# Altium project Hydra A1 UCLO 35131D.PrjPCB (part 8 of 14)

## Sheet Power Distribution Block Diagram.SchDoc: Power Distribution Block Diagram
size D; DrawnBy: C. Lewis; Engineer: C. Lewis; Address1: 4650 NORRIS CANYON RD.; Address2: SAN RAMON, CA 94583; DocumentNumber: 35133; Revision: D; SheetNumber: 17; SheetTotal: 20; PageSetup: Record=PageOptions|CenterHorizontal=True|CenterVertical=True|PrintScale=0.51|XCorrection=1.00|YCorrection=1.00|PrintKind=1|BorderSize=5000000|LeftOffset=0|BottomOffset=0|Orientation=2|PaperLength=1000|PaperWidth=1000|Scale=100|PaperSource=15|PrintQuality=600|MediaType=1|DitherType=10|PaperKind=11x17|PrintScaleMode=1
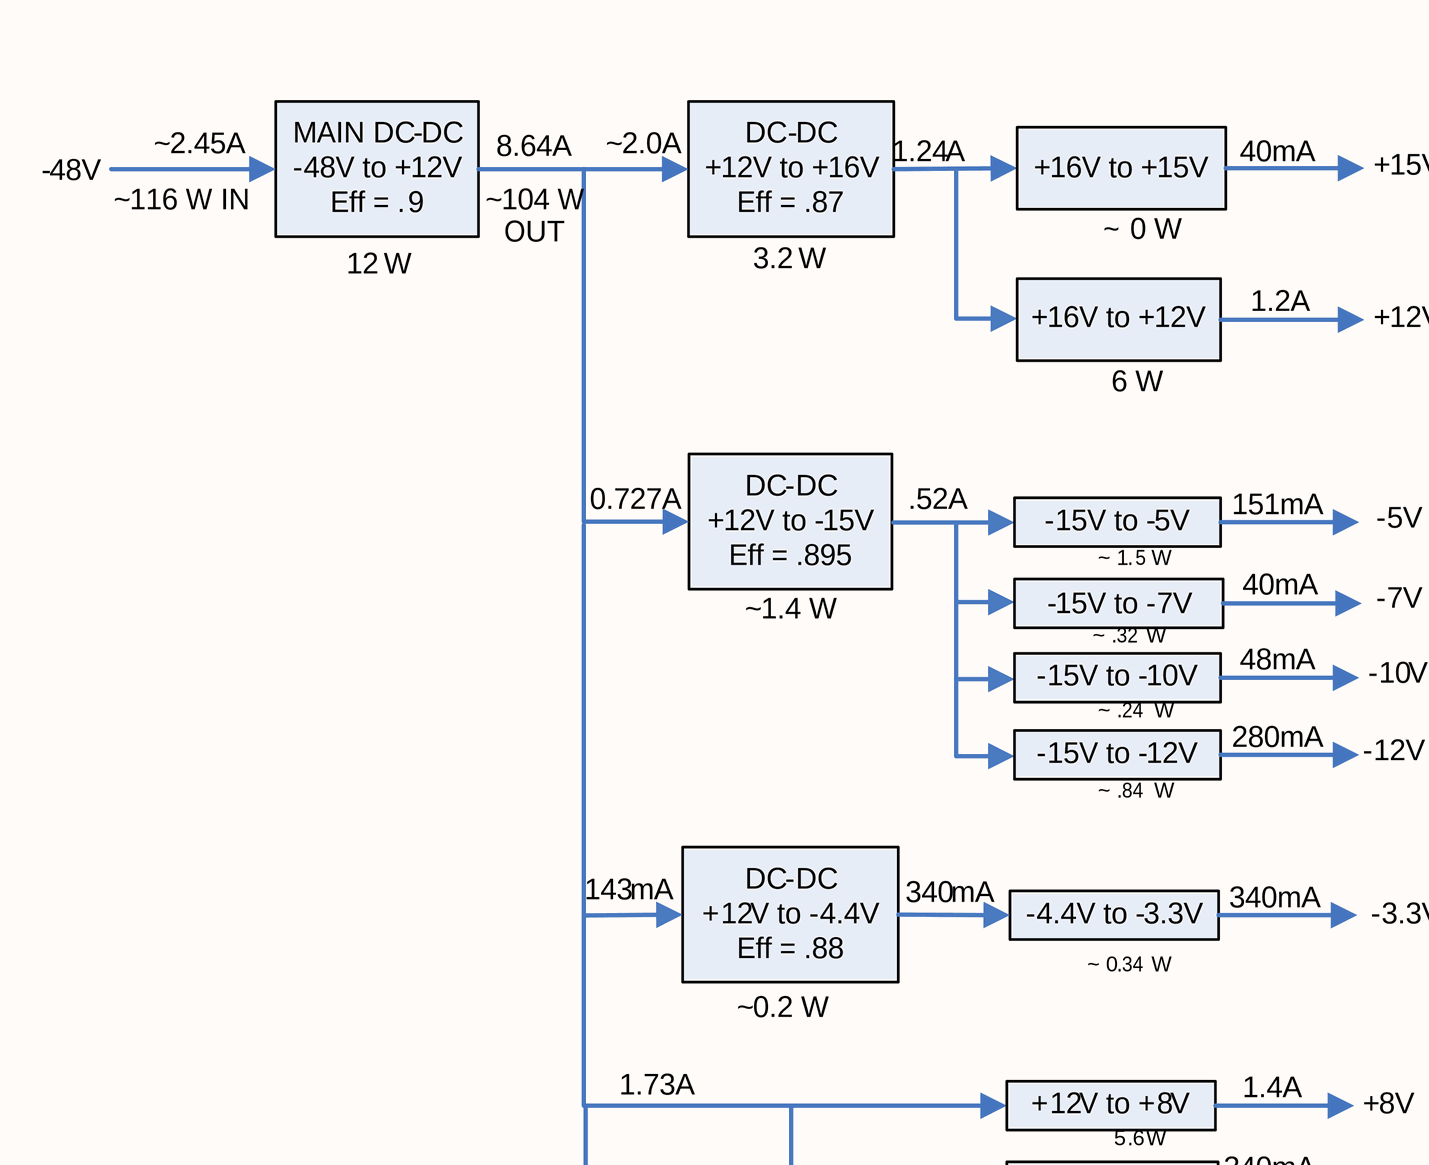
[diagram p38: Power Distribution Block Diagram.SchDoc, top left]
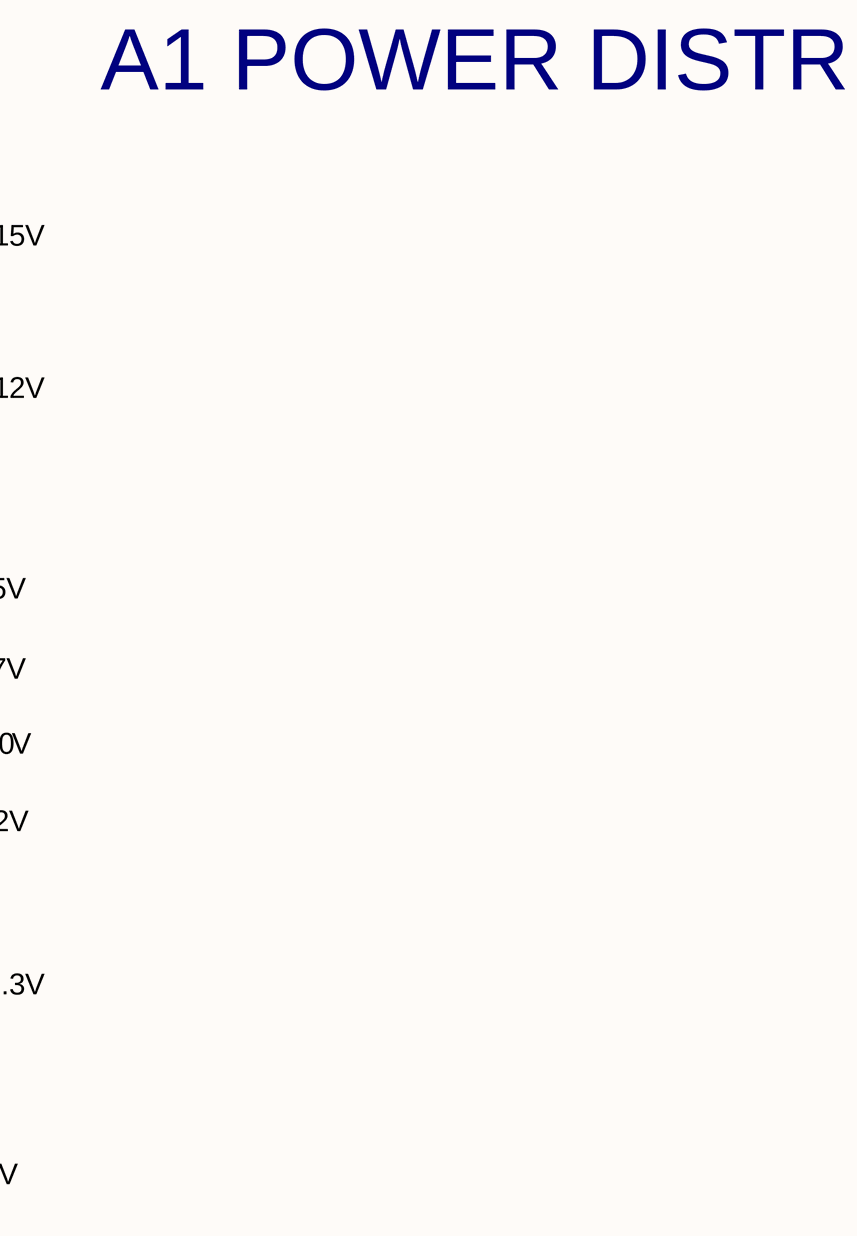
[diagram p39: Power Distribution Block Diagram.SchDoc, top middle]
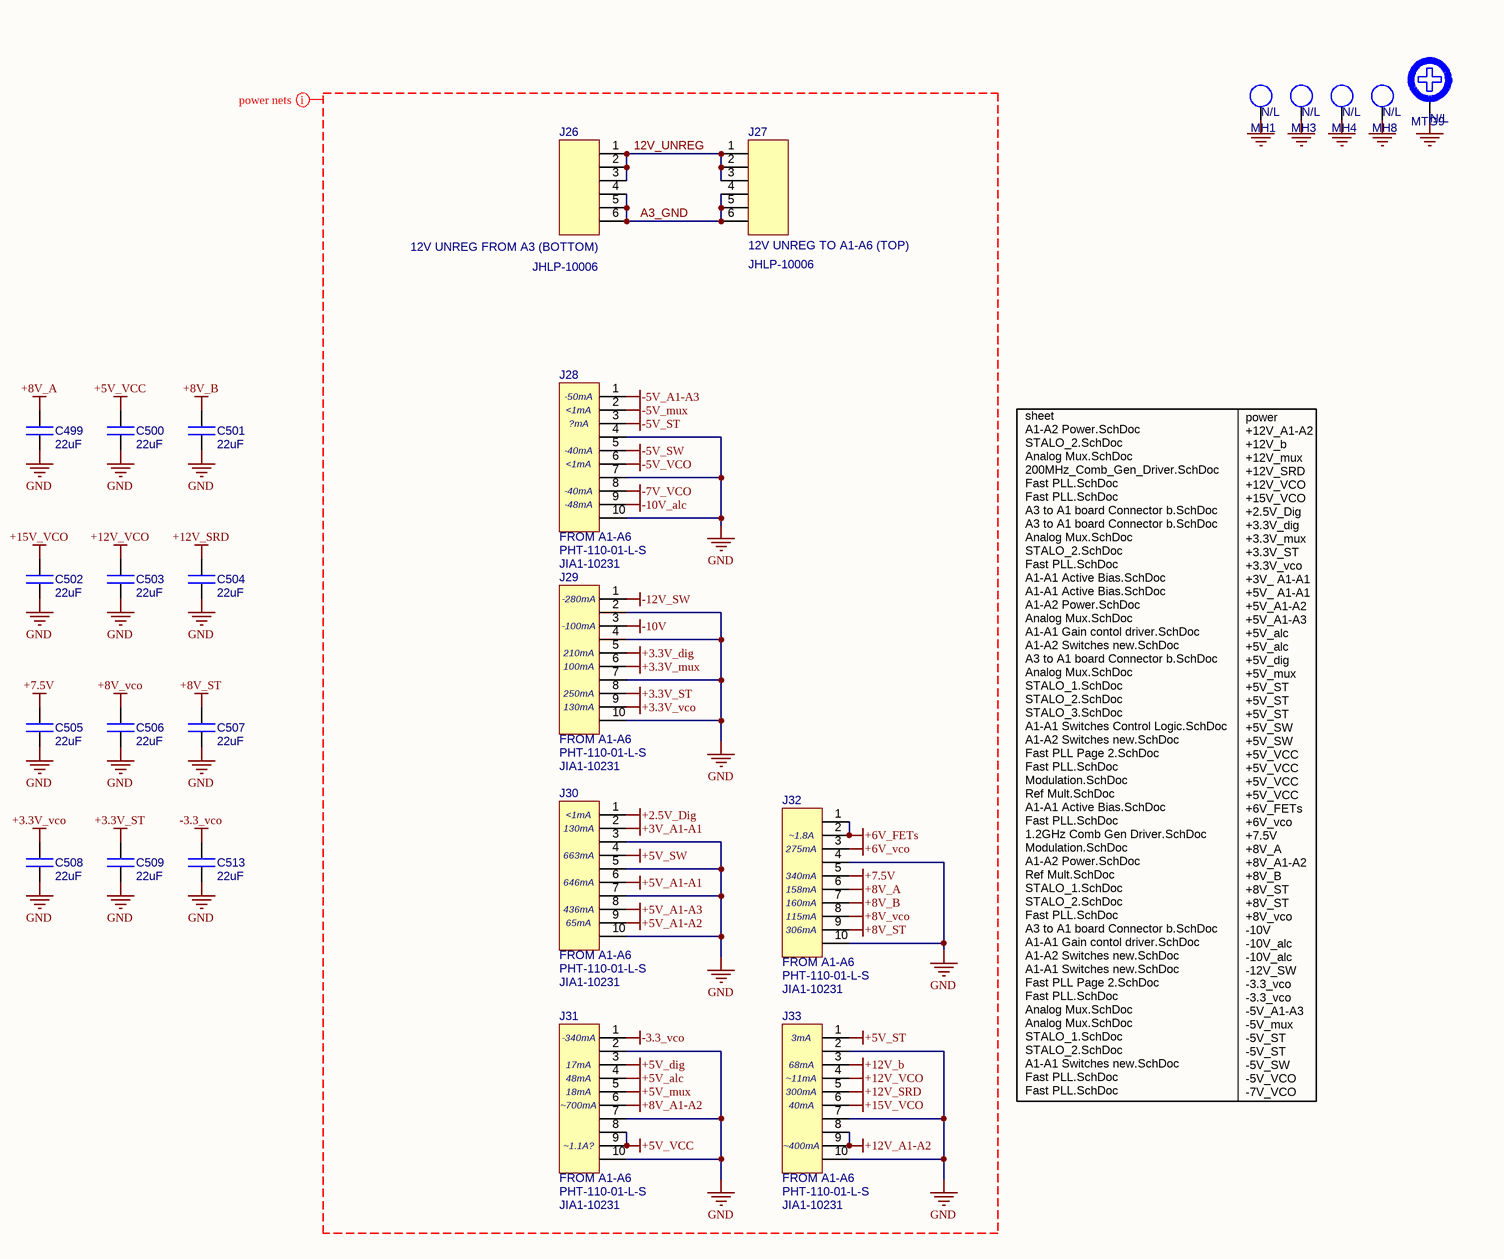
[diagram p40: Power Distribution Block Diagram.SchDoc, top right]
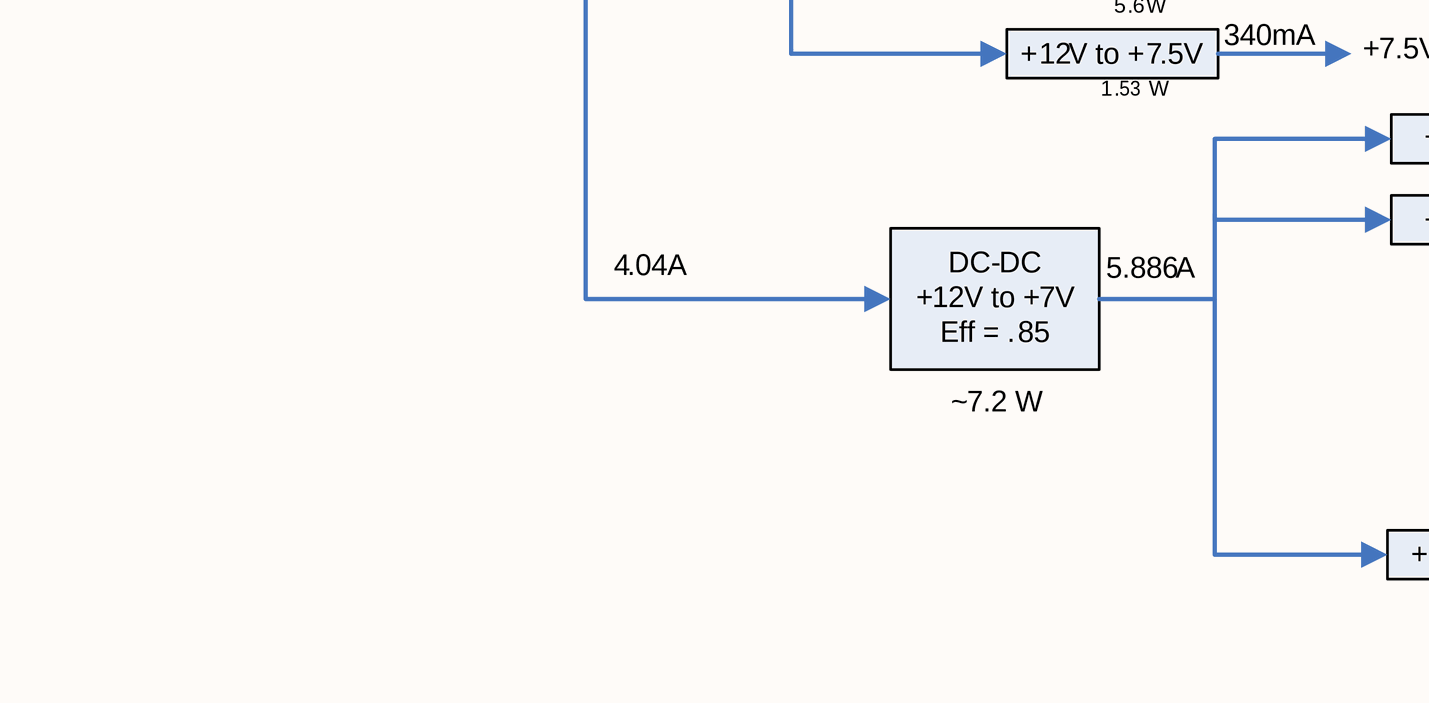
[diagram p41: Power Distribution Block Diagram.SchDoc, bottom left]
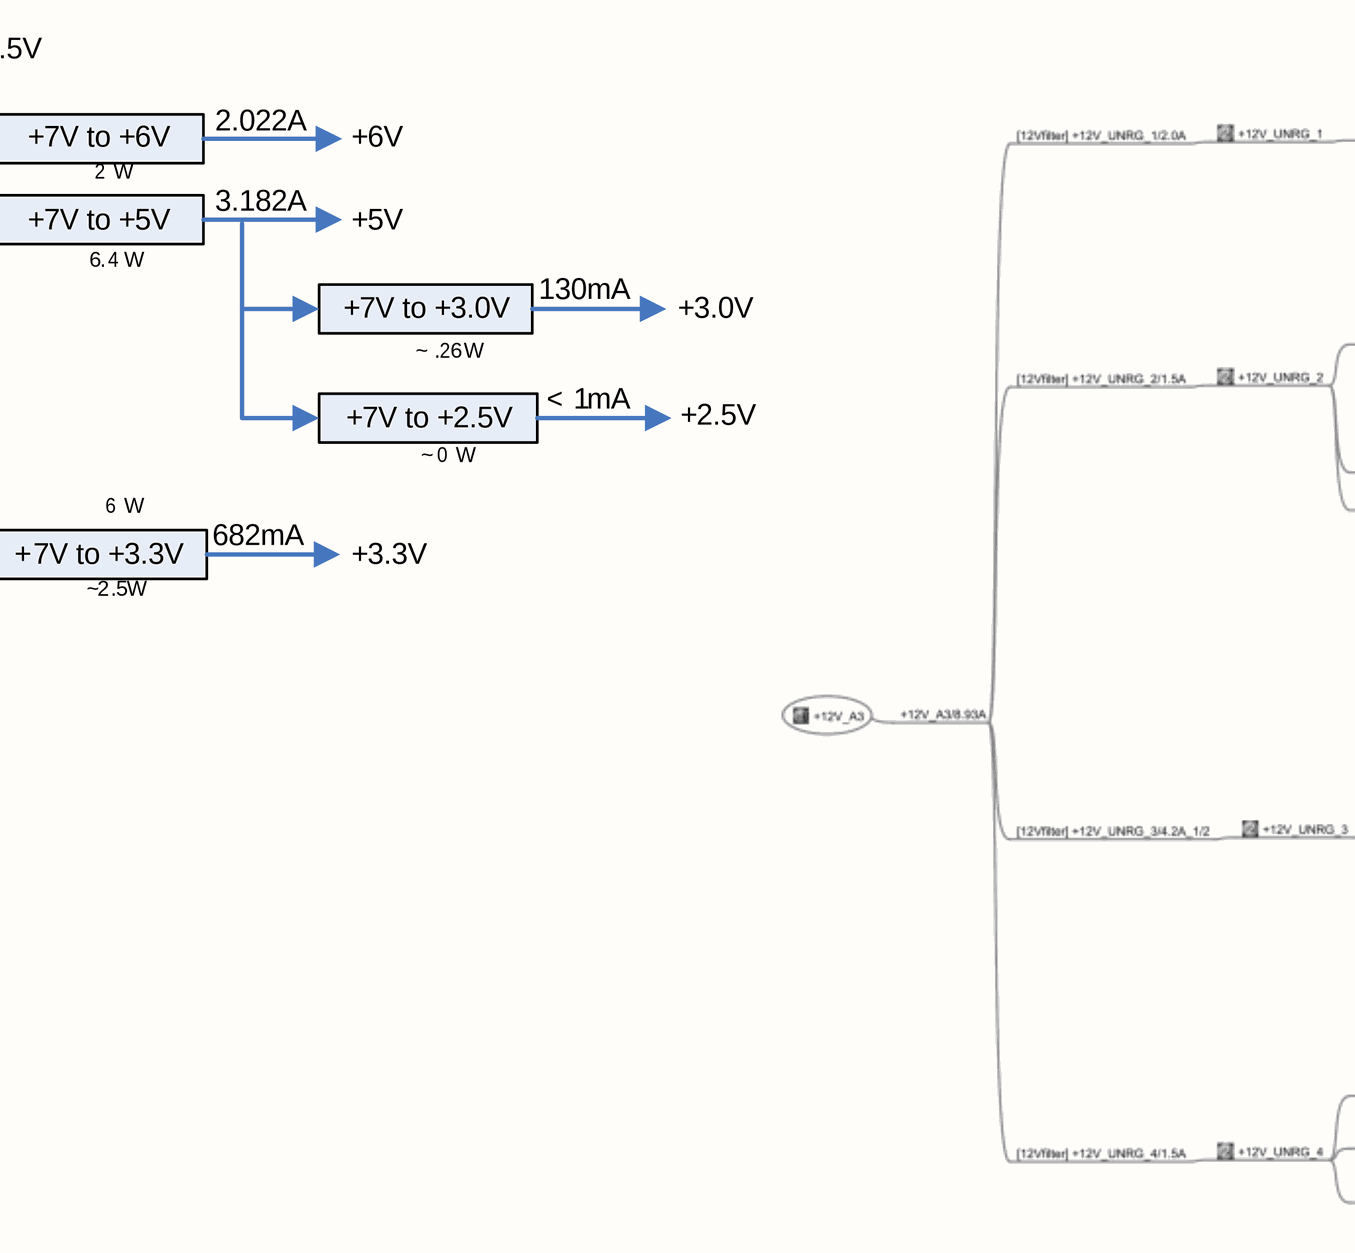
[diagram p42: Power Distribution Block Diagram.SchDoc, bottom middle]
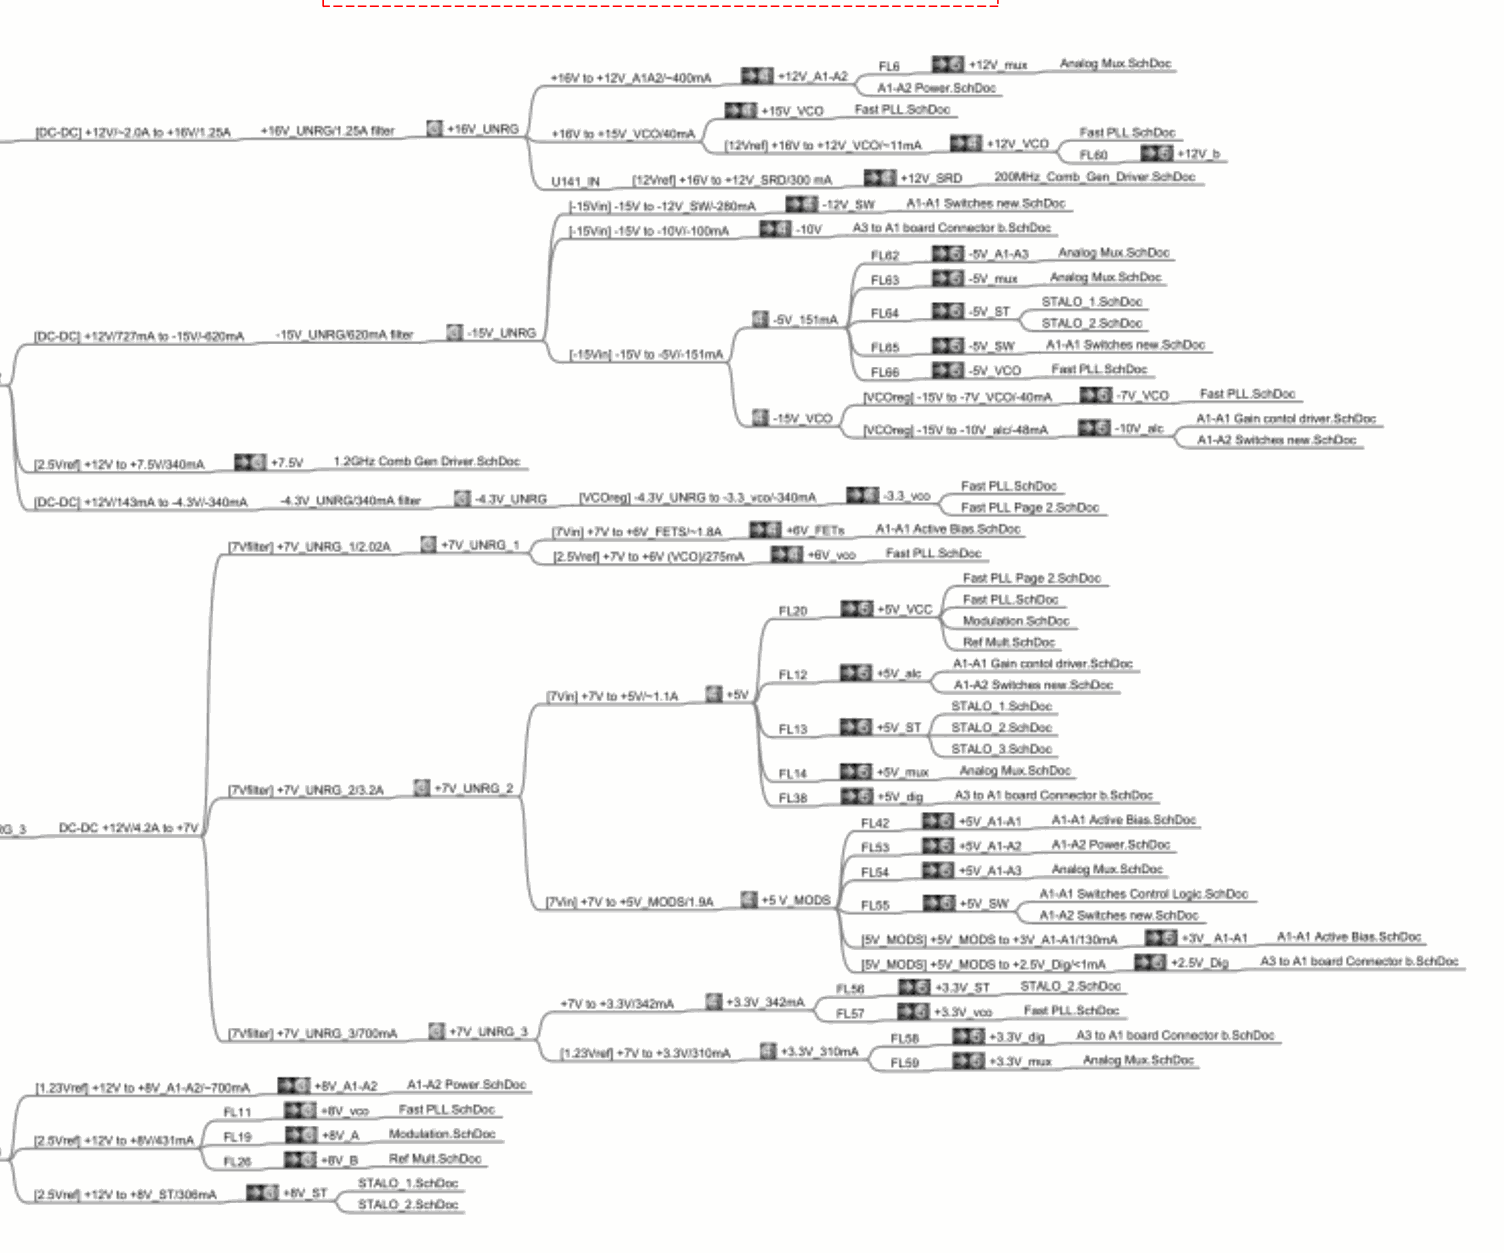
[diagram p43: Power Distribution Block Diagram.SchDoc, bottom right]

### Parts
C499  value 22uF  [CAP-1210-N]  (hidden comment: 22uF;X5R;CERAMIC CHIP;25V;1210)
C500  value 22uF  [CAP-1210-N]  (hidden comment: 22uF;X5R;CERAMIC CHIP;25V;1210)
C501  value 22uF  [CAP-1210-N]  (hidden comment: 22uF;X5R;CERAMIC CHIP;25V;1210)
C502  value 22uF  [CAP-1210-N]  (hidden comment: 22uF;X5R;CERAMIC CHIP;25V;1210)
C503  value 22uF  [CAP-1210-N]  (hidden comment: 22uF;X5R;CERAMIC CHIP;25V;1210)
C504  value 22uF  [CAP-1210-N]  (hidden comment: 22uF;X5R;CERAMIC CHIP;25V;1210)
C505  value 22uF  [CAP-1210-N]  (hidden comment: 22uF;X5R;CERAMIC CHIP;25V;1210)
C506  value 22uF  [CAP-1210-N]  (hidden comment: 22uF;X5R;CERAMIC CHIP;25V;1210)
C507  value 22uF  [CAP-1210-N]  (hidden comment: 22uF;X5R;CERAMIC CHIP;25V;1210)
C508  value 22uF  [CAP-1210-N]  (hidden comment: 22uF;X5R;CERAMIC CHIP;25V;1210)
C509  value 22uF  [CAP-1210-N]  (hidden comment: 22uF;X5R;CERAMIC CHIP;25V;1210)
C513  value 22uF  [CAP-1210-N]  (hidden comment: 22uF;X5R;CERAMIC CHIP;25V;1210)
J26  12V UNREG FROM A3 (BOTTOM)  [JHLP-10006]
J27  12V UNREG TO A1-A6 (TOP)  [JHLP-10006]
J28  FROM A1-A6  M_PN: PHT-110-01-L-S  [JIA1-10231]
J29  FROM A1-A6  M_PN: PHT-110-01-L-S  [JIA1-10231]
J30  FROM A1-A6  M_PN: PHT-110-01-L-S  [JIA1-10231]
J31  FROM A1-A6  M_PN: PHT-110-01-L-S  [JIA1-10231]
J32  FROM A1-A6  M_PN: PHT-110-01-L-S  [JIA1-10231]
J33  FROM A1-A6  M_PN: PHT-110-01-L-S  [JIA1-10231]
MH1  N/L  [MHP-250X116]
MH3  N/L  [MHP-250X116]
MH4  N/L  [MHP-250X116]
MH8  N/L  [MHP-250X116]
MTG9  NoLoad: N/L  [MHP-250X116]

### Nets
+2.5V_Dig: J30.1
+3.3V_dig: J29.5
+3.3V_mux: J29.6
+3.3V_ST: C509.2 J29.8
+3.3V_vco: C508.2 J29.9
+3V_A1-A1: J30.2
+5V_A1-A1: J30.6
+5V_A1-A2: J30.9
+5V_A1-A3: J30.8
+5V_alc: J31.4
+5V_dig: J31.3
+5V_mux: J31.5
+5V_ST: J33.1
+5V_SW: J30.4
+5V_VCC: C500.2 J31.8 J31.9
+6V_FETs: J32.1 J32.2
+6V_vco: J32.3
+7.5V: C505.2 J32.5
+8V_A: C499.2 J32.6
+8V_A1-A2: J31.6
+8V_B: C501.2 J32.7
+8V_ST: C507.2 J32.9
+8V_vco: C506.2 J32.8
+12V_A1-A2: J33.8 J33.9
+12V_b: J33.3
+12V_SRD: C504.2 J33.5
+12V_VCO: C503.2 J33.4
+15V_VCO: C502.2 J33.6
-3.3_vco: C513.2 J31.1
-5V_A1-A3: J28.1
-5V_mux: J28.2
-5V_ST: J28.3
-5V_SW: J28.5
-5V_VCO: J28.6
-7V_VCO: J28.8
-10V: J29.3
-10V_alc: J28.9
-12V_SW: J29.1
GND: C499.1 C500.1 C501.1 C502.1 C503.1 C504.1 C505.1 C506.1 C507.1 C508.1 C509.1 C513.1 J28.4 J28.7 J28.10 J29.2 J29.4 J29.7 J29.10 J30.3 J30.5 J30.7 J30.10 J31.2 J31.7 J31.10 J32.4 J32.10 J33.2 J33.7 J33.10 MH1.MH MH3.MH MH4.MH MH8.MH MTG9.MH
12V_UNREG: J26.1 J26.2 J26.3 J27.1 J27.2 J27.3
A3_GND: J26.4 J26.5 J26.6 J27.4 J27.5 J27.6

### Layout directives
net class power nets: 12V_UNREG, +2.5V_Dig, +3.3V_dig, +3.3V_mux, +3.3V_ST, +3.3V_vco, +3V_A1-A1, +5V_A1-A1, +5V_A1-A2, +5V_A1-A3, +5V_alc, +5V_dig, +5V_mux, +5V_ST, +5V_SW, +5V_VCC, +6V_FETs, +6V_vco, +7.5V, +8V_A, +8V_A1-A2, +8V_B, +8V_ST, +8V_vco, +12V_A1-A2, +12V_b, +12V_SRD, +12V_VCO, +15V_VCO, -3.3_vco, -5V_A1-A3, -5V_mux, -5V_ST, -5V_SW, -5V_VCO, -7V_VCO, -10V, -10V_alc, -12V_SW, A3_GND, GND

### Notes on the sheet
- A1 POWER DISTRIBUTION
- (near J28) -50mA
- (near J28) <1mA
- (near J28) -40mA
- (near J28) ?mA
- (near J28) -48mA
- (near J29) -280mA
- (near J29) -100mA
- (near J29) 210mA
- (near J29) 100mA
- (near J29) 250mA
- (near J29) 130mA
- (near J30) <1mA
- (near J30) 130mA
- (near J30) 646mA
- (near J30) 663mA
- (near J32) ~1.8A
- (near J32) 275mA
- (near J32) 340mA
- (near J32) 158mA
- (near J30) 65mA
- (near J30) 436mA
- (near J32) 160mA
- (near J32) 306mA
- (near J32) 115mA
- (near J31) -340mA
- (near J31) 17mA
- (near J31) 48mA
- (near J33) 3mA
- (near J33) 68mA
- (near J33) ~11mA
- (near J31) ~1.1A?
- (near J31) 18mA
- (near J31) ~700mA
- (near J33) ~400mA
- (near J33) 300mA
- (near J33) 40mA
- sheet
  A1-A2 Power.SchDoc
  STALO_2.SchDoc
  Analog Mux.SchDoc
  200MHz_Comb_Gen_Driver.SchDoc
  Fast PLL.SchDoc
  Fast PLL.SchDoc
  A3 to A1 board Connector b.SchDoc
  A3 to A1 board Connector b.SchDoc
  Analog Mux.SchDoc
  STALO_2.SchDoc
  Fast PLL.SchDoc
  A1-A1 Active Bias.SchDoc
  A1-A1 Active Bias.SchDoc
  A1-A2 Power.SchDoc
  Analog Mux.SchDoc
  A1-A1 Gain contol driver.SchDoc
  A1-A2 Switches new.SchDoc
  A3 to A1 board Connector b.SchDoc
  Analog Mux.SchDoc
  STALO_1.SchDoc
  STALO_2.SchDoc
  STALO_3.SchDoc
  A1-A1 Switches Control Logic.SchDoc
  A1-A2 Switches new.SchDoc
  Fast PLL Page 2.SchDoc
  Fast PLL.SchDoc
  Modulation.SchDoc
  Ref Mult.SchDoc
  A1-A1 Active Bias.SchDoc
  Fast PLL.SchDoc
  1.2GHz Comb Gen Driver.SchDoc
  Modulation.SchDoc
  A1-A2 Power.SchDoc
  Ref Mult.SchDoc
  STALO_1.SchDoc
  STALO_2.SchDoc
  Fast PLL.SchDoc
  A3 to A1 board Connector b.SchDoc
  A1-A1 Gain contol driver.SchDoc
  A1-A2 Switches new.SchDoc
  A1-A1 Switches new.SchDoc
  Fast PLL Page 2.SchDoc
  Fast PLL.SchDoc
  Analog Mux.SchDoc
  Analog Mux.SchDoc
  STALO_1.SchDoc
  STALO_2.SchDoc
  A1-A1 Switches new.SchDoc
  Fast PLL.SchDoc
  Fast PLL.SchDoc
- power
  +12V_A1-A2
  +12V_b
  +12V_mux
  +12V_SRD
  +12V_VCO
  +15V_VCO
  +2.5V_Dig
  +3.3V_dig
  +3.3V_mux
  +3.3V_ST
  +3.3V_vco
  +3V_ A1-A1
  +5V_ A1-A1
  +5V_A1-A2
  +5V_A1-A3
  +5V_alc
  +5V_alc
  +5V_dig
  +5V_mux
  +5V_ST
  +5V_ST
  +5V_ST
  +5V_SW
  +5V_SW
  +5V_VCC
  +5V_VCC
  +5V_VCC
  +5V_VCC
  +6V_FETs
  +6V_vco
  +7.5V
  +8V_A
  +8V_A1-A2
  +8V_B
  +8V_ST
  +8V_ST
  +8V_vco
  -10V
  -10V_alc
  -10V_alc
  -12V_SW
  -3.3_vco
  -3.3_vco
  -5V_A1-A3
  -5V_mux
  -5V_ST
  -5V_ST
  -5V_SW
  -5V_VCO
  -7V_VCO
- Title
- Sheet Title
- PRINTED DOCUMENT IS CONSIDERED UNCONTROLLED. VERIFY REVISION IN PLM SYSTEM.
- THIS DOCUMENT CONTAINS PROPRIETARY INFORMATION. DESIGN RIGHTS BELONG TO GIGA-TRONICS AND MAY NOT BE REPRODUCED WITHOUT WRITTEN AUTHORIZATION FOR ANY REASON EXCEPT CALIBRATION, OPERATION AND MAINTENANCE.
- Size
- CAGE CODE
- Filename
- D
- Document Number
- 58900
- Date
- Sheet
- Rev
- of

### Library data of the parts
C499-C509 C513 = CK60-26220: Approved: CL; NoLoad: .; MFGR: ANY; level: 1; line_number: 212; G_PN: CK60-26220; ModifyDate: 3/23/13; M_PN: ANY; item_number: CK60-26220
J26 J27 = JHLP-10006: LOCKING HEADER;.1CNTR;6PIN STR; Approved: FV; NoLoad: .; MFGR: AMP; M_PN: 641126-6; level: 1; line_number: 487; ModifyDate: 07/23/2013; G_PN: JHLP-10006; item_number: JHLP-10006
J28-J33 = JIA1-10231: STRIPLINE PLUG;.1 CTR;10 PIN;SINGLE ROW;.230;PRESS FIT;GOLD; NoLoad: .; MFGR: SAMTEC; level: 1; line_number: 490; ModifyDate: 08/14/2013; G_PN: JIA1-10231; item_number: JIA1-10231
MH1 MH3 MH4 MH8 = MHP-250X116: level: 1; NoLoad: N/L; ModifyDate: 02/14/2008 14:07:19; Value: *
MTG9 = MHP250X116: level: 1; ModifyDate: 8/8/13; Value: *

## Sheet A1-A2 Power.SchDoc: A1-A2 Power
size D; DrawnBy: C. Lewis; Engineer: C. Lewis; Address1: 4650 NORRIS CANYON RD.; Address2: SAN RAMON, CA 94583; DocumentNumber: 35133; Revision: D; SheetNumber: 7; SheetTotal: 20
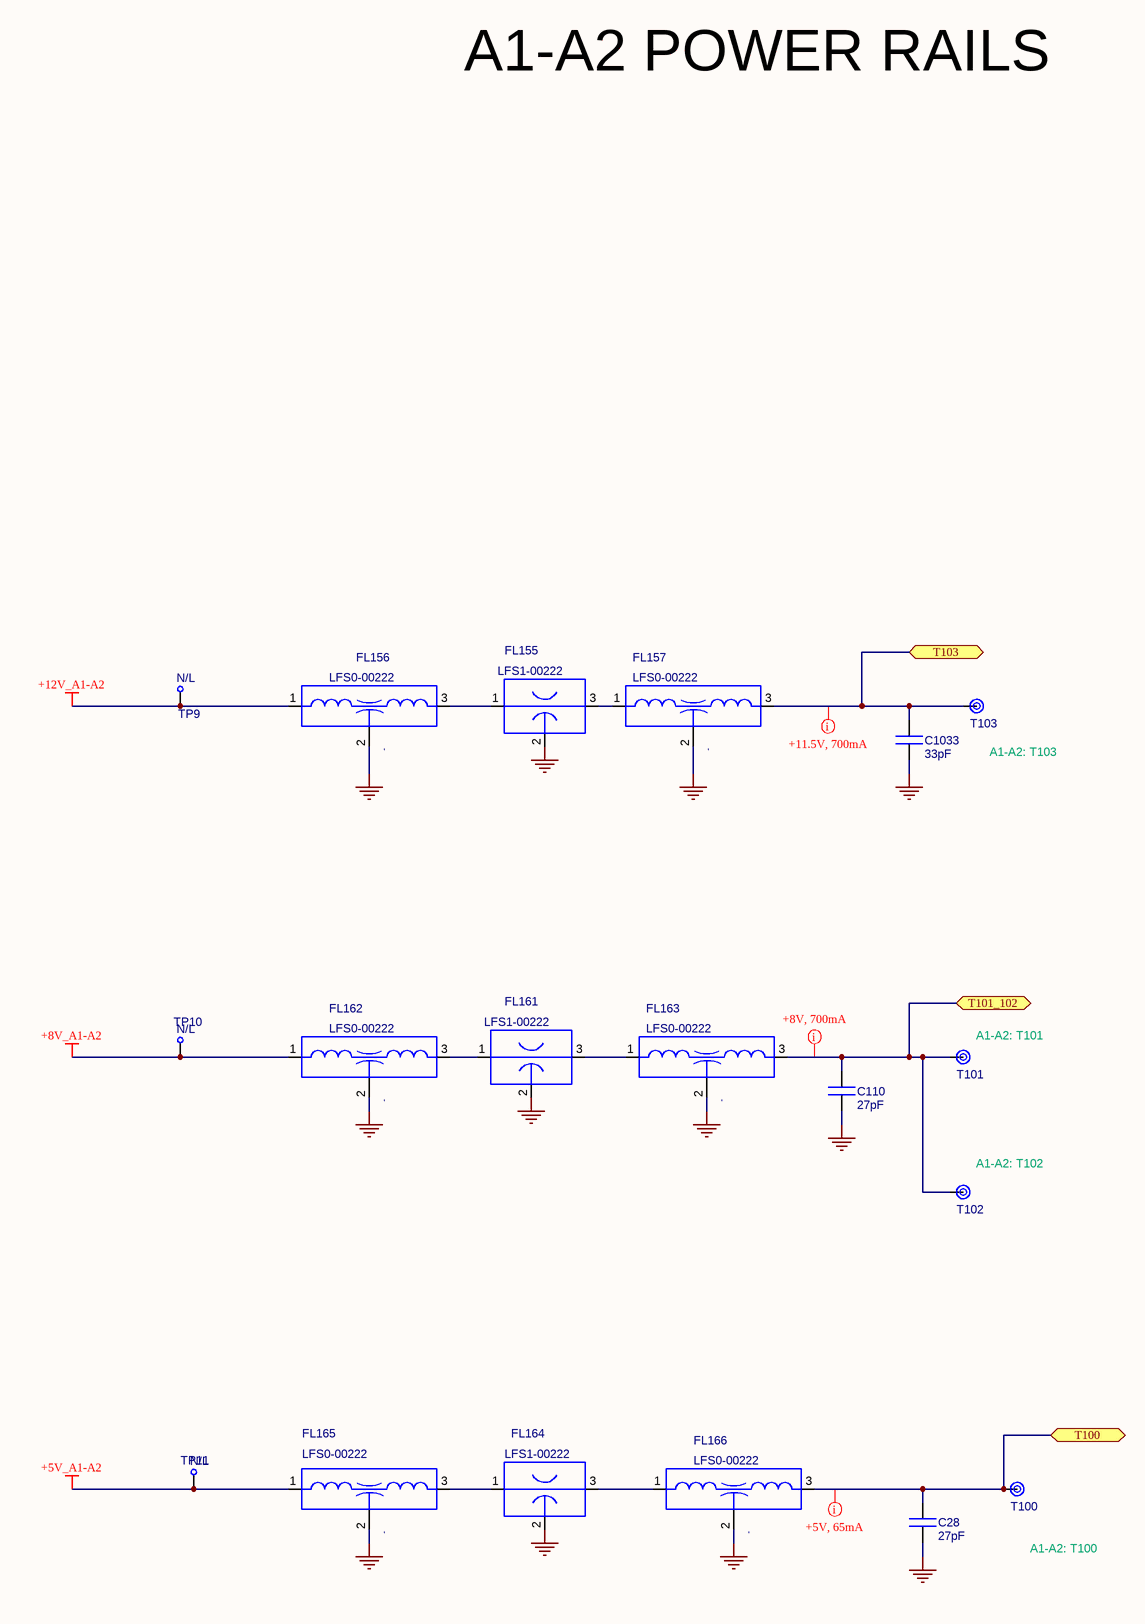
[diagram p44: A1-A2 Power.SchDoc]

### Parts
C28  value 27pF  [CAP-0402-N]  (hidden comment: 27 PF;5%;COG;>50V;CHIP;0402)
C110  value 27pF  [CAP-0402-N]  (hidden comment: 27 PF;5%;COG;>50V;CHIP;0402)
C1033  value 33pF  [CAP-0402-N]  (hidden comment: 33 PF;5%;COG;>50V;CHIP;0402)
FL155  NFM18CC222R1C3  [FIL-NFL18C]  (value not drawn)
FL156  Filter EMI 2200PF,1206  [FIL-NFE31P-1206-4P]  (value not drawn)
FL157  Filter EMI 2200PF,1206  [FIL-NFE31P-1206-4P]  (value not drawn)
FL161  NFM18CC222R1C3  [FIL-NFL18C]  (value not drawn)
FL162  Filter EMI 2200PF,1206  [FIL-NFE31P-1206-4P]  (value not drawn)
FL163  Filter EMI 2200PF,1206  [FIL-NFE31P-1206-4P]  (value not drawn)
FL164  NFM18CC222R1C3  [FIL-NFL18C]  (value not drawn)
FL165  Filter EMI 2200PF,1206  [FIL-NFE31P-1206-4P]  (value not drawn)
FL166  Filter EMI 2200PF,1206  [FIL-NFE31P-1206-4P]  (value not drawn)
T100  A1-A2: T100  [JIB0-11254]
T101  A1-A2: T101  [JIB0-11254]
T102  A1-A2: T102  [JIB0-11254]
T103  A1-A2: T103  [JIB0-11254]
TP9  NoLoad: N/L  [TP-060]  (hidden comment: .)
TP10  NoLoad: N/L  [TP-060]  (hidden comment: .)
TP11  NoLoad: N/L  [TP-060]  (hidden comment: .)

### Ports
T100, T101_102, T103

### Nets
+5V_A1-A2: FL165.1(IN) TP11.1
+8V_A1-A2: FL162.1(IN) TP10.1
+12V_A1-A2: FL156.1(IN) TP9.1
GND: C28.2 C110.1 C1033.1 FL155.2 FL156.2(GND) FL157.2(GND) FL161.2 FL162.2(GND) FL163.2(GND) FL164.2 FL165.2(GND) FL166.2(GND)
NetA1_T100: C28.1 FL166.3(OUT) T100.1 ; port T100
NetA1_T101: C110.2 FL163.3(OUT) T101.1 T102.1 ; port T101_102
NetA1_T103: C1033.2 FL157.3(OUT) T103.1 ; port T103
NetFL155_1: FL155.1 FL156.3(OUT)
NetFL155_3: FL155.3 FL157.1(IN)
NetFL161_1: FL161.1 FL162.3(OUT)
NetFL161_3: FL161.3 FL163.1(IN)
NetFL164_1: FL164.1 FL165.3(OUT)
NetFL164_3: FL164.3 FL166.1(IN)

### Layout directives
net class +11.5V, 700mA: NetA1_T103
net class +8V, 350mA: NetA1_T101
net class +5V, 65mA: NetA1_T100

### Notes on the sheet
- A1-A2 POWER RAILS
- Title
- Sheet Title
- PRINTED DOCUMENT IS CONSIDERED UNCONTROLLED. VERIFY REVISION IN PLM SYSTEM.
- THIS DOCUMENT CONTAINS PROPRIETARY INFORMATION. DESIGN RIGHTS BELONG TO GIGA-TRONICS AND MAY NOT BE REPRODUCED WITHOUT WRITTEN AUTHORIZATION FOR ANY REASON EXCEPT CALIBRATION, OPERATION AND MAINTENANCE.
- Size
- CAGE CODE
- Filename
- D
- Document Number
- 58900
- Date
- Sheet
- Rev
- of
- (in symbol LFS0-00222) ,

### Library data of the parts
C28 = CK40-00270: MFGR: ANY; Approved: CL; NoLoad: .; level: 1; line_number: 215; ModifyDate: 02/22/12; M_PN: ANY; G_PN: CK40-00270; item_number: CK40-00270
C110 = CK40-00270: Approved: CL; MFGR: ANY; NoLoad: .; level: 1; line_number: 215; ModifyDate: 02/22/12; G_PN: CK40-00270; M_PN: ANY; item_number: CK40-00270
C1033 = CK40-00330: Approved: CL; MFGR: ANY; NoLoad: .; level: 1; line_number: 295; ModifyDate: 3/9/13; G_PN: CK40-00330; M_PN: ANY; item_number: CK40-00330
FL155 FL161 FL164 = LFS1-00222: 2200 PF FEED THRU FILTER 0603; Value: 2200pF; Approved: NM; MFGR: muRata; NoLoad: .; level: 1; line_number: 475; G_PN: LFS1-00222; ModifyDate: 11/14/12; M_PN: NFM18CC222R1C3; item_number: LFS1-00222
FL156 FL157 FL162 FL163 FL165 FL166 = LFS0-00222: as FL6 on sheet 200MHz_Comb_Gen_Driver; G_PN: LFS0-00222; ModifyDate: 02/22/12; Value: 2200pF; item_number: LFS0-00222
T100-T103 = JIB0-11254: SOCKET;SINGLE;.018-.040 ID X .254;OPEN;GLD; M_PN: 380635; MFGR: AMP; NoLoad: .; Approved: NM; level: 1; line_number: 1065; ModifyDate: 11/30/12; G_PN: JIB0-11254; item_number: JIB0-11254
TP9-TP11 = TP-060: Approved: NM; level: 1; MFGR: N/A; M_PN: N/A

## Sheet Ref Mult.SchDoc: Ref Mult
size D; Date: 09-24-10; DrawnBy: C. Lewis; Engineer: C. Lewis; Address1: 4650 NORRIS CANYON RD.; Address2: SAN RAMON, CA 94583; DocumentNumber: 35133; Revision: D; SheetNumber: 12; SheetTotal: 20; PageSetup: Record=PageOptions|CenterHorizontal=False|CenterVertical=False|PrintScale=0.50|XCorrection=1.00|YCorrection=1.00|PrintKind=0|BorderSize=5000000|LeftOffset=0|BottomOffset=0|Orientation=2|PaperLength=1000|PaperWidth=1000|Scale=100|PaperSource=15|PrintQuality=600|MediaType=1|DitherType=10|PaperKind=Letter|PrintScaleMode=0; DocumentName: Sheet1.SCHDOC; ModifiedDate: 10-27-11
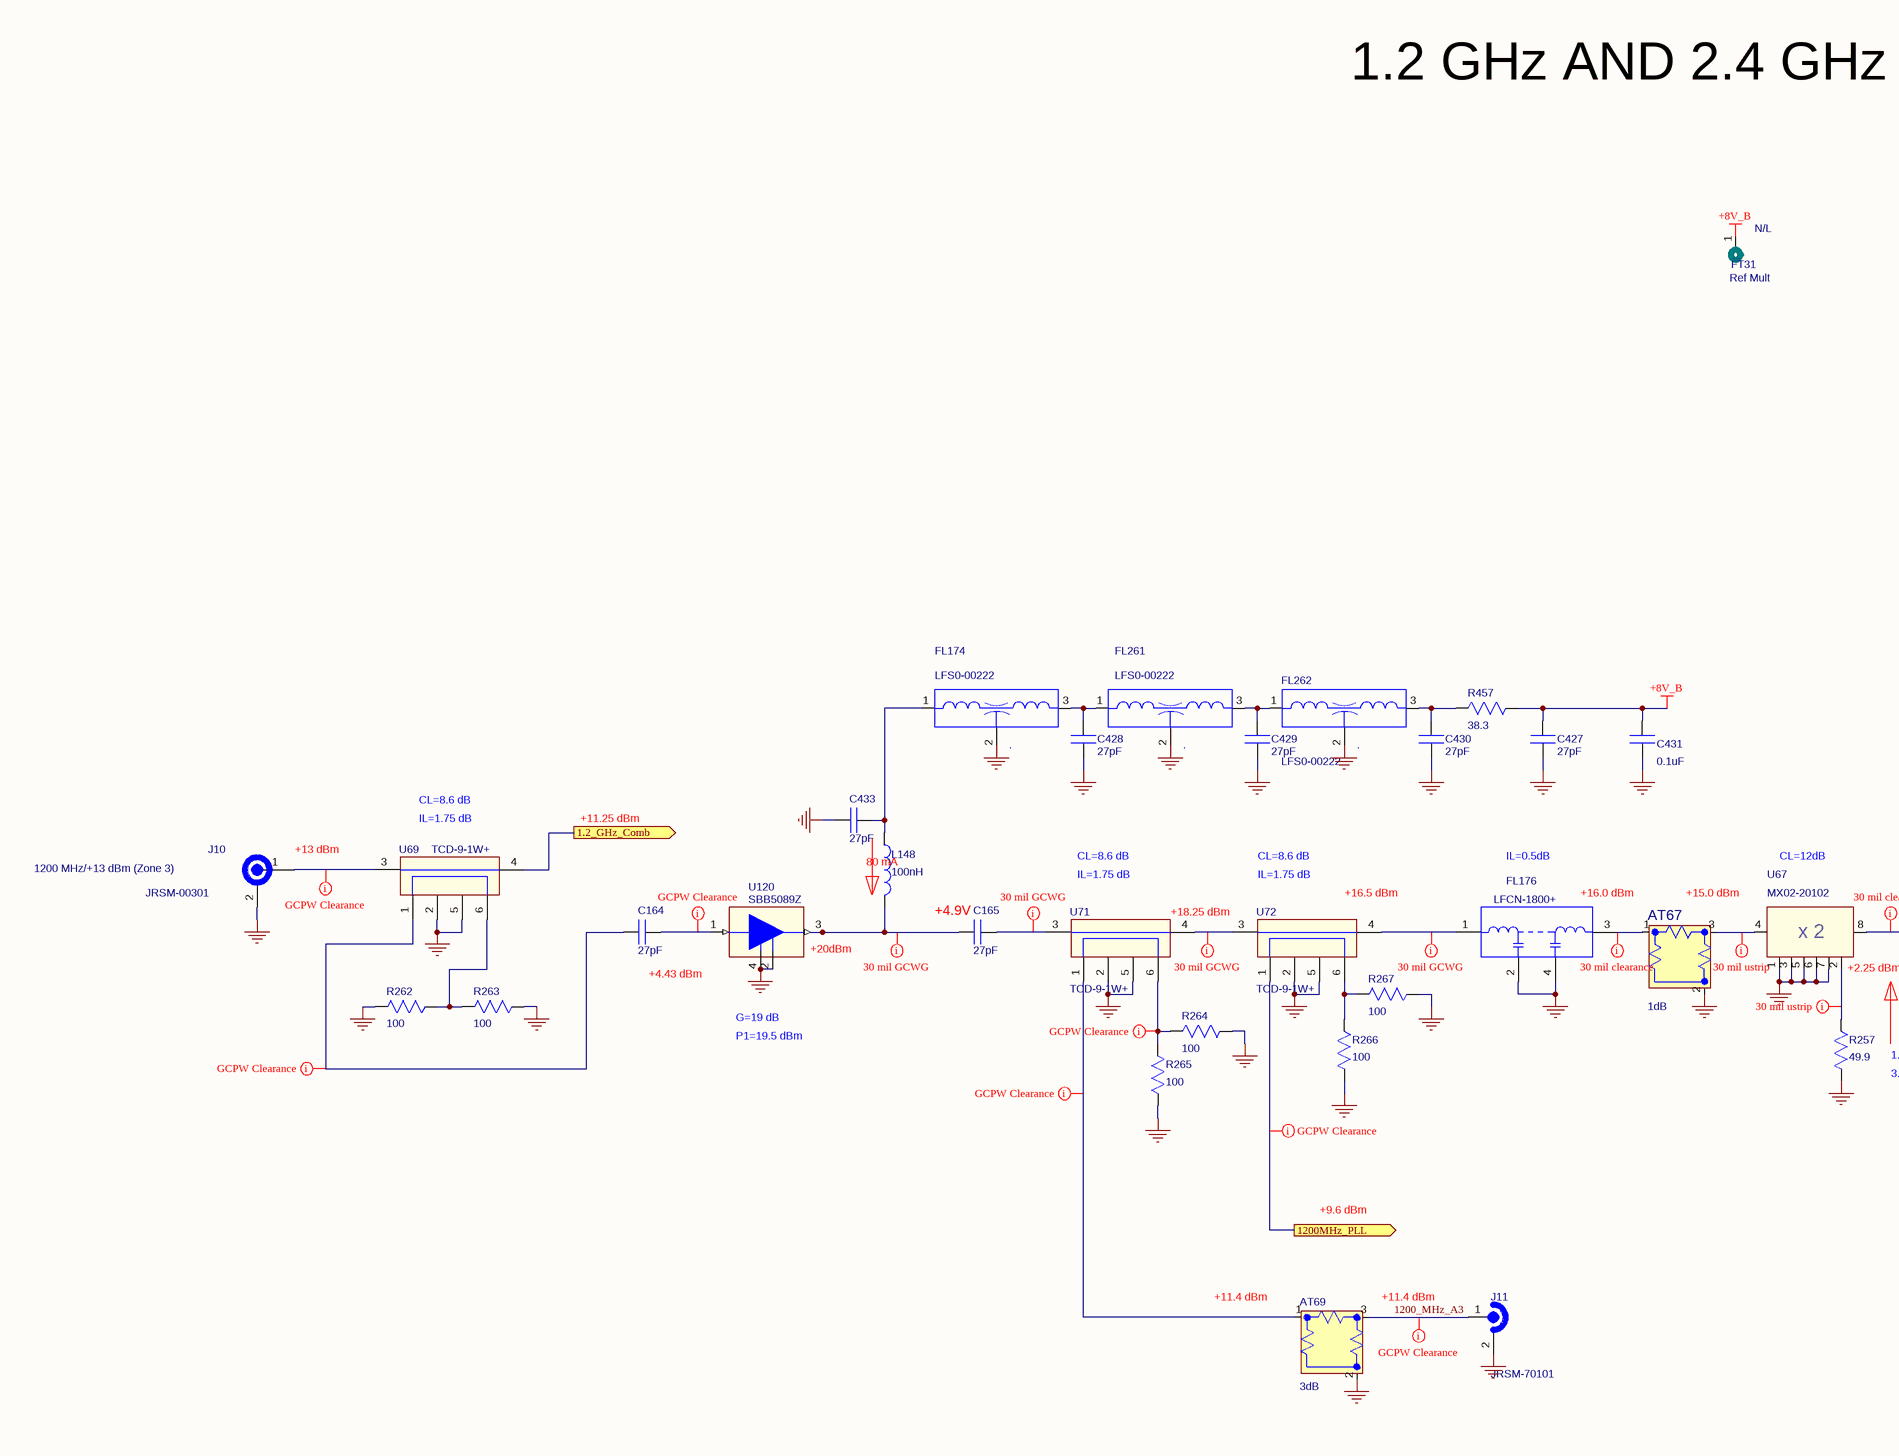
[diagram p45: Ref Mult.SchDoc, left]
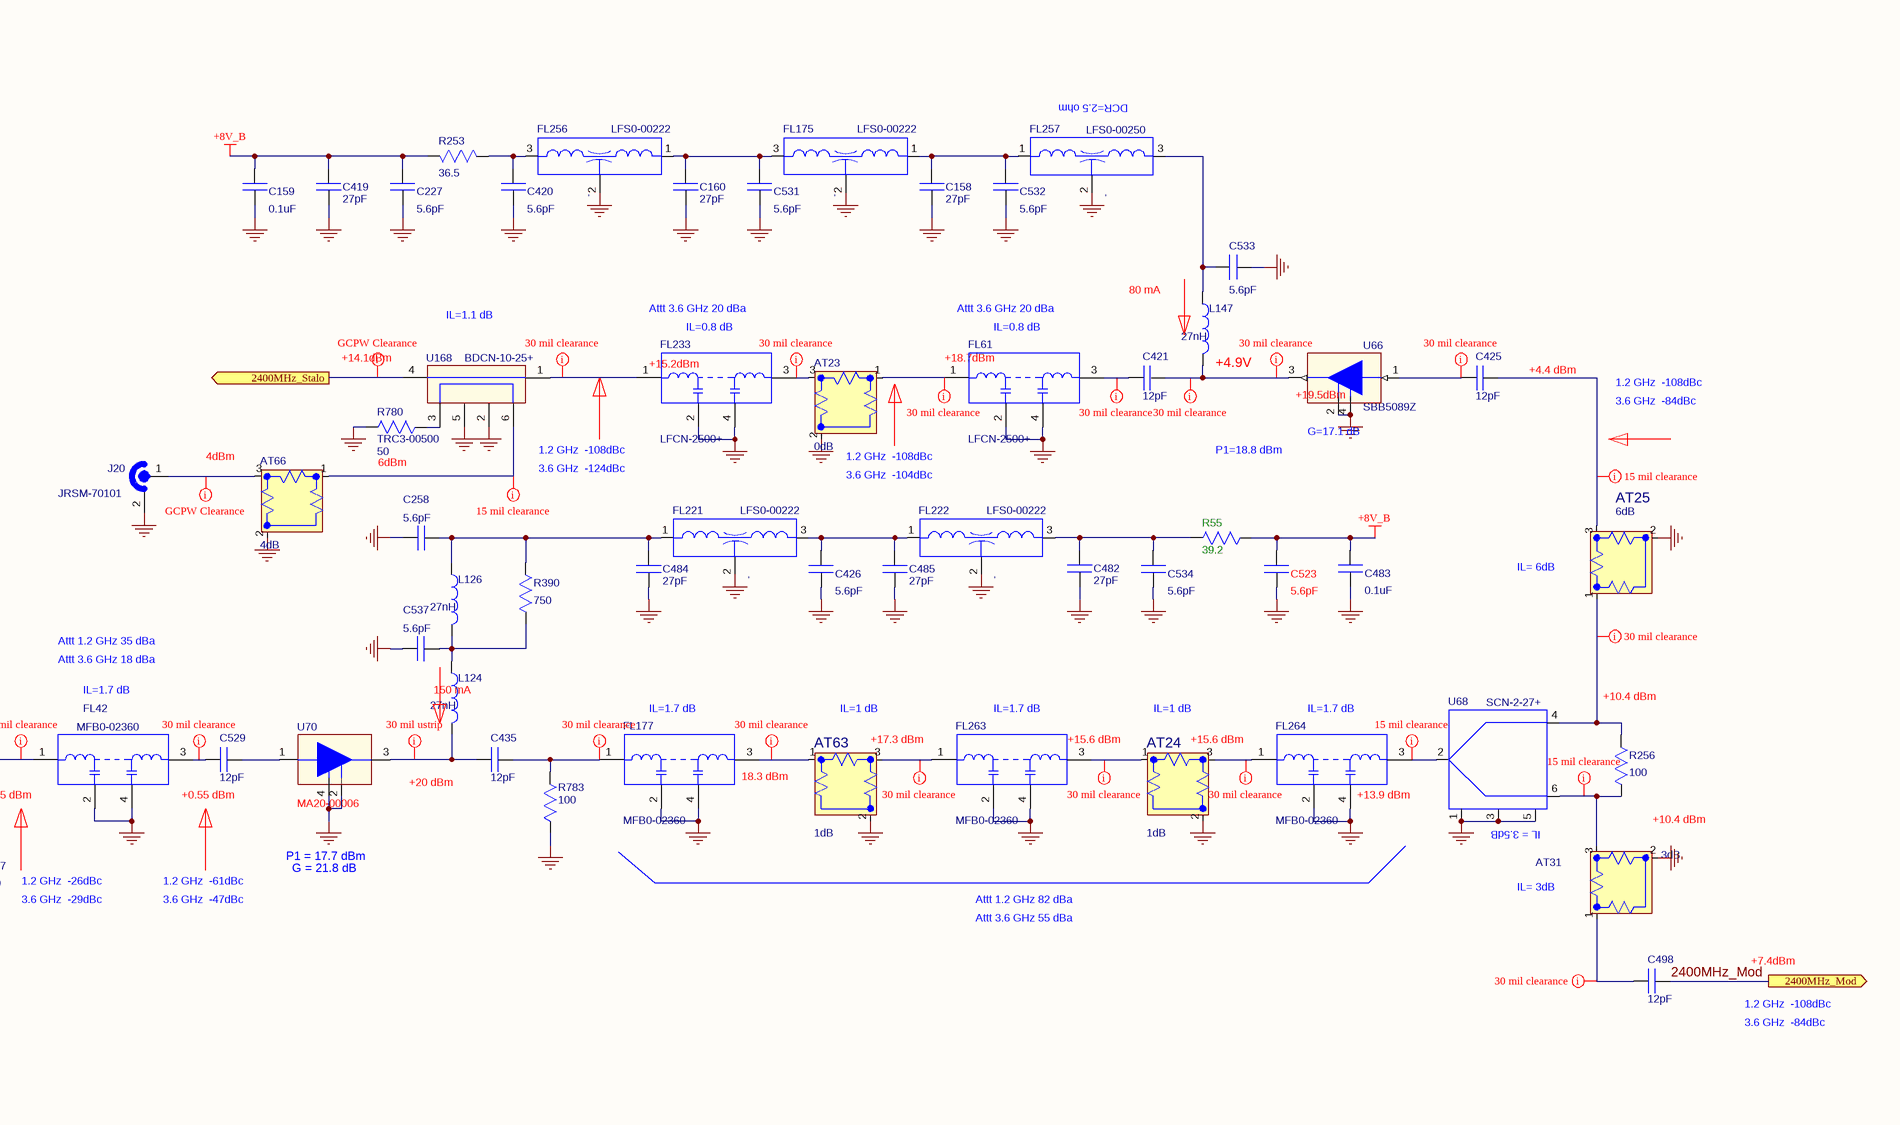
[diagram p46: Ref Mult.SchDoc, right]

### Parts
AT23  value 0dB  [ATTN-IMS-0805]  (hidden comment: PAD;CHIP;0dB;+/-.3dB;.08 x .05;50 OHM;FACE DOWN)
AT24  value 1dB  [ATTN-IMS-0805]  (hidden comment: PAD;CHIP;1dB;+/-.3dB;.08 x .05;50 OHM;FACE DOWN)
AT25  value 6dB  [ATTN-IMS-0805]  (hidden comment: PAD;CHIP;6dB;+/-.3dB;.08 x .05;50 OHM;FACE DOWN)
AT31  value 3dB  [ATTN-IMS-0805]  (hidden comment: PAD;CHIP;3dB;+/-.3dB;.08 x .05;50 OHM;FACE DOWN)
AT63  value 1dB  [ATTN-IMS-0805]  (hidden comment: PAD;CHIP;1dB;+/-.3dB;.08 x .05;50 OHM;FACE DOWN)
AT66  value 4dB  [ATTN-IMS-0805]  (hidden comment: PAD;CHIP;4dB;+/-.3dB;.08 x .05;50 OHM;FACE DOWN)
AT67  value 1dB  [ATTN-IMS-0805]  (hidden comment: PAD;CHIP;1dB;+/-.3dB;.08 x .05;50 OHM;FACE DOWN)
AT69  value 3dB  [ATTN-IMS-0805]  (hidden comment: PAD;CHIP;3dB;+/-.3dB;.08 x .05;50 OHM;FACE DOWN)
C158  value 27pF  [CAP-0402-N]  (hidden comment: 27 PF;5%;COG;>50V;CHIP;0402)
C159  value 0.1uF  [CAP-0603-H035-N]  (hidden comment: .1UF;10%;X7R;16V;CHIP;0603)
C160  value 27pF  [CAP-0402-N]  (hidden comment: 27 PF;5%;COG;>50V;CHIP;0402)
C164  value 27pF  [CAP-0402-N]  (hidden comment: 27 PF;5%;COG;>50V;CHIP;0402)
C165  value 27pF  [CAP-0402-N]  (hidden comment: 27 PF;5%;COG;>50V;CHIP;0402)
C227  value 5.6pF  [CAP-0402-RF]  (hidden comment: 5.6 PF;200V;.1PF;HIGH Q;SMT;CERAMIC;0402)
C258  value 5.6pF  [CAP-0402-RF]  (hidden comment: 5.6 PF;200V;.1PF;HIGH Q;SMT;CERAMIC;0402)
C419  value 27pF  [CAP-0402-N]  (hidden comment: 27 PF;5%;COG;>50V;CHIP;0402)
C420  value 5.6pF  [CAP-0402-RF]  (hidden comment: 5.6 PF;200V;.1PF;HIGH Q;SMT;CERAMIC;0402)
C421  value 12pF  [CAP-0402-N]  (hidden comment: 12 PF;5%;COG;>50V;CHIP;0402)
C425  value 12pF  [CAP-0402-N]  (hidden comment: 12 PF;5%;COG;>50V;CHIP;0402)
C426  value 5.6pF  [CAP-0402-RF]  (hidden comment: 5.6 PF;200V;.1PF;HIGH Q;SMT;CERAMIC;0402)
C427  value 27pF  [CAP-0402-N]  (hidden comment: 27 PF;5%;COG;>50V;CHIP;0402)
C428  value 27pF  [CAP-0402-N]  (hidden comment: 27 PF;5%;COG;>50V;CHIP;0402)
C429  value 27pF  [CAP-0402-N]  (hidden comment: 27 PF;5%;COG;>50V;CHIP;0402)
C430  value 27pF  [CAP-0402-N]  (hidden comment: 27 PF;5%;COG;>50V;CHIP;0402)
C431  value 0.1uF  [CAP-0603-H035-N]  (hidden comment: .1UF;10%;X7R;16V;CHIP;0603)
C433  value 27pF  [CAP-0402-N]  (hidden comment: 27 PF;5%;COG;>50V;CHIP;0402)
C435  value 12pF  [CAP-0402-N]  (hidden comment: 12 PF;5%;COG;>50V;CHIP;0402)
C482  value 27pF  [CAP-0402-N]  (hidden comment: 27 PF;5%;COG;>50V;CHIP;0402)
C483  value 0.1uF  [CAP-0603-H035-N]  (hidden comment: .1UF;10%;X7R;16V;CHIP;0603)
C484  value 27pF  [CAP-0402-N]  (hidden comment: 27 PF;5%;COG;>50V;CHIP;0402)
C485  value 27pF  [CAP-0402-N]  (hidden comment: 27 PF;5%;COG;>50V;CHIP;0402)
C498  value 12pF  [CAP-0402-N]  (hidden comment: 12 PF;5%;COG;>50V;CHIP;0402)
C523  value 5.6pF  [CAP-0402-RF]  (hidden comment: 5.6 PF;200V;.1PF;HIGH Q;SMT;CERAMIC;0402)
C529  value 12pF  [CAP-0402-N]  (hidden comment: 12 PF;5%;COG;>50V;CHIP;0402)
C531  value 5.6pF  [CAP-0402-RF]  (hidden comment: 5.6 PF;200V;.1PF;HIGH Q;SMT;CERAMIC;0402)
C532  value 5.6pF  [CAP-0402-RF]  (hidden comment: 5.6 PF;200V;.1PF;HIGH Q;SMT;CERAMIC;0402)
C533  value 5.6pF  [CAP-0402-RF]  (hidden comment: 5.6 PF;200V;.1PF;HIGH Q;SMT;CERAMIC;0402)
C534  value 5.6pF  [CAP-0402-RF]  (hidden comment: 5.6 PF;200V;.1PF;HIGH Q;SMT;CERAMIC;0402)
C537  value 5.6pF  [CAP-0402-RF]  (hidden comment: 5.6 PF;200V;.1PF;HIGH Q;SMT;CERAMIC;0402)
FL42  2360 MHZ BANDPASS FILTER 220 MHZ BW;3.2X1.3mm;FV1206;4 PIN  [FV1206]  (value not drawn)
FL61  M_PN: LFCN-2500+  [FV1206]  (hidden comment: FILTER;LOW PASS;2.500GHZ;5 SECTIONS;1A;1206)
FL174  Filter EMI 2200PF,1206  [FIL-NFE31P-1206-4P]  (value not drawn)
FL175  Filter EMI 2200PF,1206  [FIL-NFE31P-1206-4P]  (value not drawn)
FL176  M_PN: LFCN-1800+  [FV1206]  (hidden comment: FILTER;LOW PASS;1800MHZ;7SECTIONS;10W;FV1206;RoHS)
FL177  2360 MHZ BANDPASS FILTER 220 MHZ BW;3.2X1.3mm;FV1206;4 PIN  [FV1206]  (value not drawn)
FL221  Filter EMI 2200PF,1206  [FIL-NFE31P-1206-4P]  (value not drawn)
FL222  Filter EMI 2200PF,1206  [FIL-NFE31P-1206-4P]  (value not drawn)
FL233  M_PN: LFCN-2500+  [FV1206]  (hidden comment: FILTER;LOW PASS;2.500GHZ;5 SECTIONS;1A;1206)
FL256  Filter EMI 2200PF,1206  [FIL-NFE31P-1206-4P]  (value not drawn)
FL257  F/T FILTER;CHIP;2.5 DCR150MA;16V;T LC;25PF;200MHz;0603  [FIL-NFL18ST]  (value not drawn)
FL261  Filter EMI 2200PF,1206  [FIL-NFE31P-1206-4P]  (value not drawn)
FL262  Filter EMI 2200PF,1206  [FIL-NFE31P-1206-4P]  (value not drawn)
FL263  2360 MHZ BANDPASS FILTER 220 MHZ BW;3.2X1.3mm;FV1206;4 PIN  [FV1206]  (value not drawn)
FL264  2360 MHZ BANDPASS FILTER 220 MHZ BW;3.2X1.3mm;FV1206;4 PIN  [FV1206]  (value not drawn)
FT31  Ref Mult  NoLoad: N/L  [FromToNode_ML2]  (net tie, no BOM)
J10  1200 MHz/+13 dBm (Zone 3)  [CONN-3211-60035_plane_cutout]
J11  .  [JRSM-70101]  (value not drawn)
J20  .  [JRSM-70101]  (value not drawn)
L124  value 27nH  [IND-0603HP]  (hidden comment: INDUCTOR;27NH;2%;2.8G SRF;74Q @0.9G;.150DCR;.78A;0603)
L126  value 27nH  [IND-0603HP]  (hidden comment: INDUCTOR;27NH;2%;2.8G SRF;74Q @0.9G;.150DCR;.78A;0603)
L147  value 27nH  [IND-0603HP]  (hidden comment: INDUCTOR;27NH;2%;2.8G SRF;74Q @0.9G;.150DCR;.78A;0603)
L148  value 100nH  [IND-0603CS]  (hidden comment: INDUCTOR;100NH;5%;1.4GHZ SRF;34Q;.58 DCR;400MA;WIREWOUND;0603)
R55  value 39.2  [RES-2010-N]  (hidden comment: 39.2 OHM;.75W;1%;100PPM;FILM CHIP;2010)
R253  value 36.5  [RES-2010-N]  (hidden comment: 36.5 OHM;.75W;1%;100PPM;FILM CHIP;2010)
R256  value 100  [RES-0603-N]  (hidden comment: 100 OHMS; 1%; .1W; 100PPM; FILM; CHIP; 0603)
R257  value 49.9  [RES-0402-N]  (hidden comment: 49.9 OHMS;.06W;1%;200PPM;FILM;CHIP;0402)
R262  value 100  [RES-0402-N]  (hidden comment: 100 OHMS; 1%; .1W; 100PPM; FILM; CHIP; 0402)
R263  value 100  [RES-0402-N]  (hidden comment: 100 OHMS; 1%; .1W; 100PPM; FILM; CHIP; 0402)
R264  value 100  [RES-0402-N]  (hidden comment: 100 OHMS; 1%; .1W; 100PPM; FILM; CHIP; 0402)
R265  value 100  [RES-0402-N]  (hidden comment: 100 OHMS; 1%; .1W; 100PPM; FILM; CHIP; 0402)
R266  value 100  [RES-0402-N]  (hidden comment: 100 OHMS; 1%; .1W; 100PPM; FILM; CHIP; 0402)
R267  value 100  [RES-0402-N]  (hidden comment: 100 OHMS; 1%; .1W; 100PPM; FILM; CHIP; 0402)
R390  value 750  [RES-0402-N]  (hidden comment: 750 OHMS;.1W;1%;100PPM;FILM CHIP;0402)
R457  value 38.3  [RES-2010-N]  (hidden comment: 38.3 OHM;.75W;1%;100PPM;FILM CHIP;2010)
R780  value 50  [RES-0402-N]  (hidden comment: RES;50 OHM;CHIP;5%;250PPM;PART WRAP;0402)
R783  value 100  [RES-0201-N]  (hidden comment: 100 OHMS;.05W;1%;100PPM;FILM CHIP;0201)
U66  M_PN: SBB5089Z  [SOT-89]  (hidden comment: AMP;.05-6GHZ;+21DBM;5V;75MA;SOT-89; RoHS)
U67  DOUBLER;850-2000 MHZ IN;15DB CONV LOSS;10-20DBM IN;SO-8  [HV1195]  (value not drawn)
U68  M_PN: SCN-2-27+  [FV1206-1-PS]  (hidden comment: LRPS-2-1J+)
U69  M_PN: TCD-9-1W+  [CPLR-DB714]  (hidden comment: COUPLER;8.9DB;5-2000 MHZ;1.2DB LOSS;DB714 SMT CASE)
U70  AMP;0-6GHZ;20DB;+20DBM;5V;100MA;SOT-89  [SOT-89]  (value not drawn)
U71  M_PN: TCD-9-1W+  [CPLR-DB714]  (hidden comment: COUPLER;8.9DB;5-2000 MHZ;1.2DB LOSS;DB714 SMT CASE)
U72  M_PN: TCD-9-1W+  [CPLR-DB714]  (hidden comment: COUPLER;8.9DB;5-2000 MHZ;1.2DB LOSS;DB714 SMT CASE)
U120  M_PN: SBB5089Z  [SOT-89]  (hidden comment: AMP;.05-6GHZ;+21DBM;5V;75MA;SOT-89; RoHS)
U168  M_PN: BDCN-10-25+  [FV1206-1-PS]  (hidden comment: COUPLER;10DB;820-2525 MHZ;1.5DB LOSS;FV1206-1 SMT CASE)

### Ports
1.2_GHz_Comb, 1200MHz_PLL, 2400MHz_Mod, 2400MHz_Stalo

### Nets
+8V_B: C159.1 C227.1 C419.1 C427.1 C431.1 C483.1 C523.2 FT31.1 R55.2 R253.2 R457.1
GND: AT23.2(GND) AT24.2(GND) AT25.2(GND) AT31.2(GND) AT63.2(GND) AT66.2(GND) AT67.2(GND) AT69.2(GND) C158.2 C159.2 C160.2 C227.2 C258.2 C419.2 C420.2 C426.1 C427.2 C428.2 C429.2 C430.2 C431.2 C433.2 C482.2 C483.2 C484.1 C485.1 C523.1 C531.2 C532.2 C533.2 C534.1 C537.1 FL42.2(GND) FL42.4(GND) FL61.2(GND) FL61.4(GND) FL174.2(GND) FL175.2(GND) FL176.2(GND) FL176.4(GND) FL177.2(GND) FL177.4(GND) FL221.2(GND) FL222.2(GND) FL233.2(GND) FL233.4(GND) FL256.2(GND) FL257.2(GND) FL261.2(GND) FL262.2(GND) FL263.2(GND) FL263.4(GND) FL264.2(GND) FL264.4(GND) J10.2(GND) J11.2(GND) J20.2(GND) R257.1 R262.1 R263.2 R264.1 R265.2 R266.1 R267.2 R780.1 R783.1 U66.2(GND) U66.4(GND) U67.1(GND) U67.3(GND) U67.5(GND) U67.6(GND) U67.7(GND) U68.1(GND) U68.3(GND) U68.5(GND) U69.2 U69.5 U70.2(GND) U70.4 U71.2 U71.5 U72.2 U72.5 U120.2(GND) U120.4(GND) U168.2(GND) U168.5(GND)
1200_MHz_A3: AT69.3(IN/OUT) J11.1(CNTR)
2400MHz_Mod: C498.2 ; port 2400MHz_Mod
NetAT23_1: AT23.1(IN/OUT) FL61.1(IN)
NetAT23_3: AT23.3(IN/OUT) FL233.3(OUT)
NetAT24_1: AT24.1(IN/OUT) FL263.3(OUT)
NetAT24_3: AT24.3(IN/OUT) FL264.1(IN)
NetAT25_1: AT25.1(IN/OUT) R256.2 U68.4
NetAT25_3: AT25.3(IN/OUT) C425.1
NetAT31_1: AT31.1(IN/OUT) C498.1
NetAT31_3: AT31.3(IN/OUT) R256.1 U68.6
NetAT63_1: AT63.1(IN/OUT) FL177.3(OUT)
NetAT63_3: AT63.3(IN/OUT) FL263.1(IN)
NetAT66_1: AT66.1(IN/OUT) U168.6(CPL_(FWD))
NetAT66_3: AT66.3(IN/OUT) J20.1(CNTR)
NetAT67_1: AT67.1(IN/OUT) FL176.3(OUT)
NetAT67_3: AT67.3(IN/OUT) U67.4(IN)
NetAT69_1: AT69.1(IN/OUT) U71.1
NetC158_1: C158.1 C532.1 FL175.1(IN) FL257.1(IN)
NetC160_1: C160.1 C531.1 FL175.3(OUT) FL256.1(IN)
NetC164_1: C164.1 U69.1
NetC164_2: C164.2 U120.1(RF_IN)
NetC165_1: C165.1 L148.1 U120.3(RF_OUT)
NetC165_2: C165.2 U71.3
NetC258_1: C258.1 C484.2 FL221.1(IN) L126.2 R390.2
NetC420_1: C420.1 FL256.3(OUT) R253.1
NetC421_1: C421.1 FL61.3(OUT)
NetC421_2: C421.2 L147.1 U66.3(RF_OUT)
NetC425_2: C425.2 U66.1(RF_IN)
NetC426_2: C426.2 C485.2 FL221.3(OUT) FL222.1(IN)
NetC428_1: C428.1 FL174.3(OUT) FL261.1(IN)
NetC429_1: C429.1 FL261.3(OUT) FL262.1(IN)
NetC430_1: C430.1 FL262.3(OUT) R457.2
NetC433_1: C433.1 FL174.1(IN) L148.2
NetC435_1: C435.1 L124.1 U70.3
NetC435_2: C435.2 FL177.1(IN) R783.2
NetC482_1: C482.1 C534.2 FL222.3(OUT) R55.1
NetC522_2: U69.4 ; port 1.2_GHz_Comb
NetC529_1: C529.1 FL42.3(OUT)
NetC529_2: C529.2 U70.1
NetC533_1: C533.1 FL257.3(OUT) L147.2
NetC537_2: C537.2 L124.2 L126.1 R390.1
NetFL42_1: FL42.1(IN) U67.8(OUT)
NetFL176_1: FL176.1(IN) U72.4
NetFL233_1: FL233.1(IN) U168.1(INPUT)
NetFL246_1: U72.1 ; port 1200MHz_PLL
NetFL264_3: FL264.3(OUT) U68.2
NetJ10_1: J10.1 U69.3
NetR257_2: R257.2 U67.2(TERM)
NetR262_2: R262.2 R263.1 U69.6
NetR264_2: R264.2 R265.1 U71.6
NetR266_2: R266.2 R267.1 U72.6
NetR780_2: R780.2 U168.3(CPV_(REV))
NetU1_6: U168.4(OUTPUT) ; port 2400MHz_Stalo
NetU71_4: U71.4 U72.3

### Layout directives
net class GCPW Clearance: 1200_MHz_A3, NetAT66_3, NetAT69_1, NetC164_1, NetC164_2, NetFL246_1, NetJ10_1, NetR264_2, NetU1_6
net class 30 mil clearance: NetAT23_1, NetAT23_3, NetAT24_1, NetAT24_3, NetAT25_1, NetAT31_1, NetAT63_1, NetAT63_3, NetAT67_1, NetC421_1, NetC421_2, NetC425_2, NetC435_2, NetC529_1, NetFL42_1, NetFL233_1
net class 30 mil ustrip: NetAT67_3, NetC435_1, NetR257_2
net class 15 mil clearance: NetAT25_3, NetAT31_3, NetAT66_1, NetFL264_3
net class 30 mil GCWG: NetC165_1, NetC165_2, NetFL176_1, NetU71_4

### Notes on the sheet
- 1.2 GHz AND 2.4 GHz DISTRIBUTION
- (near FL257) DCR=2.5 ohm
- IL=1.1 dB
- Attt 3.6 GHz 20 dBa
- (near FL233) IL=0.8 dB
- (near FL61) IL=0.8 dB
- (near L147) 80 mA
- +14.1dBm
- (near FL233) +15.2dBm
- +18.7dBm
- (near L147) +4.9V
- (near U66) +19.5dBm
- (near C425) +4.4 dBm
- 1.2 GHz  -108dBc
- 3.6 GHz  -84dBc
- 4dBm
- (near AT23) 1.2 GHz  -108dBc
- P1=18.8 dBm
- (near U66) G=17.1 dB
- 6dBm
- 3.6 GHz  -124dBc
- 3.6 GHz  -104dBc
- (near AT25) IL= 6dB
- (near U69) IL=1.75 dB
- CL=8.6 dB
- +11.25 dBm
- Attt 1.2 GHz 35 dBa
- (near J10) +13 dBm
- (near L148) 80 mA
- IL=1.75 dB
- IL=0.5dB
- CL=12dB
- Attt 3.6 GHz 18 dBa
- IL=1.7 dB
- (near L124) 150 mA
- +10.4 dBm
- (near L148) +4.9V
- (near U71) +18.25 dBm
- (near U72) +16.5 dBm
- +16.0 dBm
- +15.0 dBm
- (near FL177) IL=1.7 dB
- (near AT63) IL=1 dB
- (near AT63) +17.3 dBm
- (near FL263) IL=1.7 dB
- (near FL263) +15.6 dBm
- (near AT24) IL=1 dB
- (near AT24) +15.6 dBm
- (near FL264) IL=1.7 dB
- +4.43 dBm
- (near U120) +20dBm
- (near U67) +2.25 dBm
- (near FL42) +0.55 dBm
- +20 dBm
- (near FL177) 18.3 dBm
- (near FL264) +13.9 dBm
- (near U68) IL = 3.5dB
- G=19 dB
- P1=19.5 dBm
- 1.2 GHz  -26dBc
- 1.2 GHz  -61dBc
- P1 = 17.7 dBm
- G = 21.8 dB
- (near AT31) IL= 3dB
- 3.6 GHz  -29dBc
- 3.6 GHz  -47dBc
- Attt 1.2 GHz 82 dBa
- Attt 3.6 GHz 55 dBa
- +7.4dBm
- +9.6 dBm
- (near AT69) +11.4 dBm
- Title
- Sheet Title
- PRINTED DOCUMENT IS CONSIDERED UNCONTROLLED. VERIFY REVISION IN PLM SYSTEM.
- THIS DOCUMENT CONTAINS PROPRIETARY INFORMATION. DESIGN RIGHTS BELONG TO GIGA-TRONICS AND MAY NOT BE REPRODUCED WITHOUT WRITTEN AUTHORIZATION FOR ANY REASON EXCEPT CALIBRATION, OPERATION AND MAINTENANCE.
- Size
- CAGE CODE
- Filename
- D
- Document Number
- 58900
- Date
- Sheet
- Rev
- of
- (in symbol LFS0-00222) ,
- (in symbol LFS0-00250) ,
- (in symbol MX02-20102) x 2

### Library data of the parts
AT23 = MPFC-A1000: NoLoad: .; Approved: CL; M_PN: IMS1141-00DB; MFGR: IMS RESISTORS; level: 1; line_number: 50; ModifyDate: 4/16/13; G_PN: MPFC-A1000; item_number: MPFC-A1000
AT24 AT63 AT67 = MPFC-A1001: NoLoad: .; Approved: CL; M_PN: IMS1141-01DB; MFGR: IMS RESISTORS; level: 1; line_number: 15; G_PN: MPFC-A1001; item_number: MPFC-A1001
  AT67: ModifyDate: 3/8/13
AT25 = MPFC-A1006: NoLoad: .; Approved: CL; M_PN: IMS1141-06DB; MFGR: IMS RESISTORS; level: 1; line_number: 35; ModifyDate: 3/8/13; G_PN: MPFC-A1006; item_number: MPFC-A1006
AT31 AT69 = MPFC-A1003: NoLoad: .; Approved: CL; M_PN: IMS1141-03DB; MFGR: IMS RESISTORS; level: 1; line_number: 25; G_PN: MPFC-A1003; item_number: MPFC-A1003
AT66 = MPFC-A1004: NoLoad: .; Approved: CL; M_PN: IMS1141-04DB; MFGR: IMS RESISTORS; level: 1; line_number: 30; ModifyDate: 3/8/13; G_PN: MPFC-A1004; item_number: MPFC-A1004
C158 C160 C164 C165 C419 C427-C430 C433 C482 C484 C485 = CK40-00270: MFGR: ANY; Approved: CL; NoLoad: .; level: 1; line_number: 215; ModifyDate: 02/22/12; M_PN: ANY; G_PN: CK40-00270; item_number: CK40-00270
C159 C431 C483 = CK45-04100: Approved: CL; NoLoad: .; MFGR: ANY; level: 1; line_number: 105; ModifyDate: 02/22/12; G_PN: CK45-04100; M_PN: ANY; item_number: CK45-04100
C227 C258 C420 C426 C523 C531-C534 C537 = CK41-00056: MFGR: ATC; M_PN: 600L5R6BT200; Approved: CL; NoLoad: .; level: 1; line_number: 120; ModifyDate: 3/11/13; G_PN: CK41-00056; item_number: CK41-00056
C421 C425 C435 C498 C529 = CK40-00120: MFGR: ANY; Approved: CL; NoLoad: .; level: 1; line_number: 165; ModifyDate: 10/06/12; M_PN: ANY; G_PN: CK40-00120; item_number: CK40-00120
FL42 FL177 FL263 FL264 = MFB0-02360: MFGR: MINI-CIRCUITS; Approved: NM; Value: BFCN-2360+; NoLoad: .; level: 1; line_number: 365; ModifyDate: 12/04/12; M_PN: BFCN-2360+; G_PN: MFB0-02360; item_number: MFB0-02360
FL61 FL233 = MFL0-02500: MFGR: MINI-CIRCUITS; Approved: CL; Value: LFCN-2500+; NoLoad: .; level: 1; line_number: 460; G_PN: MFL0-02500; ModifyDate: 3/5/13; item_number: MFL0-02500
FL174 FL175 FL221 FL222 FL256 FL261 FL262 = LFS0-00222: Approved: CL; NoLoad: .; M_PN: NFE31PT222Z1E9BL; MFGR: MURATA; level: 1; line_number: 335; G_PN: LFS0-00222; ModifyDate: 02/22/12; Value: 2200pF; item_number: LFS0-00222
FL176 = MFL0-01800: MFGR: MINI-CIRCUITS; Approved: NM; Value: LFCN-1800+; NoLoad: .; level: 1; line_number: 360; G_PN: MFL0-01800; ModifyDate: 11/17/12; item_number: MFL0-01800
FL257 = LFS0-00250: Approved: NM; NoLoad: .; M_PN: NFL18ST207X1C3; MFGR: MURATA; level: 1; line_number: 415; ModifyDate: 02/22/12; Value: 25pF; G_PN: LFS0-00250; item_number: LFS0-00250
FT31 = FromToNode: level: 1; Approved: *; G_PN: *; MFGR: *; Value: *
J10 = JRSM-00301: SMPM;SB EDGE LAUNCH;MALE;1 PORT; Value: 3211-60035; MFGR: SV MICROWAVE; Approved: CL; NoLoad: .; level: 1; line_number: 485; M_PN: 3211-60035; ModifyDate: 5/14/12; G_PN: JRSM-00301; item_number: JRSM-00301
J11 J20 = JRSM-70101: SMPM FD MALE,STRAIGHT SMT, R/A COPLANAR, 4 PIN THRU-HOLE; Value: B012-P93-02; MFGR: GILBERT; Approved: CL; level: 1; line_number: 480; M_PN: B012-P93-02; NoLoad: .; ModifyDate: 10/15/14; G_PN: JRSM-70101; item_number: JRSM-70101
L124 L126 L147 = LSA5-03270: M_PN: 0603HP-27NXGLU; MFGR: COILCRAFT; NoLoad: .; Approved: CL; level: 1; line_number: 565; G_PN: LSA5-03270; ModifyDate: 3/11/13; item_number: LSA5-03270
L148 = LSA3-14100: MFGR: COILCRAFT; NoLoad: .; Approved: CL; M_PN: 0603CS-R10XJBU; level: 1; line_number: 525; ModifyDate: 02/22/12; G_PN: LSA3-14100; item_number: LSA3-14100
R55 = RK65-00392: NoLoad: .; MFGR: VISHAY/DALE; Approved: CL; M_PN: CRCW201039R2FKEF; level: 1; line_number: 892; ModifyDate: 10/14/14; G_PN: RK65-00392; item_number: RK65-00392
R253 = RK65-00365: Approved: CL; NoLoad: .; MFGR: VISHAY/DALE; M_PN: CRCW201036R5FKEF; level: 1; line_number: 760; ModifyDate: 3/1/13; G_PN: RK65-00365; item_number: RK65-00365
R256 = RK40-01000: NoLoad: .; MFGR: ANY; Approved: CL; level: 1; line_number: 775; ModifyDate: 4/4/12; M_PN: ANY; G_PN: RK40-01000; item_number: RK40-01000
R257 = RK35-00499: Approved: CL; NoLoad: .; MFGR: ANY; level: 1; line_number: 650; G_PN: RK35-00499; ModifyDate: 02/22/12; M_PN: ANY; item_number: RK35-00499
R262-R267 = RK35-01000: Approved: CL; NoLoad: .; MFGR: ANY; level: 1; line_number: 960; G_PN: RK35-01000; ModifyDate: 02/22/12; M_PN: ANY; item_number: RK35-01000
R390 = RK35-07500: NoLoad: .; MFGR: ANY; Approved: CL; level: 1; line_number: 785; G_PN: RK35-07500; M_PN: ANY; ModifyDate: 4/11/12; item_number: RK35-07500
R457 = RK65-00383: Approved: CL; NoLoad: .; MFGR: VISHAY/DALE; M_PN: CRCW201038R3FKEF; level: 1; line_number: 955; ModifyDate: 3/1/13; G_PN: RK65-00383; item_number: RK65-00383
R780 = TRC3-00500: Approved: CL; NoLoad: .; MFGR: ANY; level: 1; line_number: 860; G_PN: TRC3-00500; ModifyDate: 02/27/13; M_PN: ANY; item_number: TRC3-00500
R783 = RK30-01000: NoLoad: .; MFGR: Vishay-Dala; M_PN: CRCW0201100RFKED; Approved: CL; level: 1; line_number: 787; ModifyDate: 7/23/13; G_PN: RK30-01000; item_number: RK30-01000
U66 U120 = MA21-00006: NoLoad: .; Approved: XiaoXiao; MFGR: RFMD; level: 1; line_number: 1270; Value: +21dBm; ModifyDate: 03/27/2012; item_number: MA21-00006
U67 = MX02-20102: NoLoad: .; Approved: CL; MFGR: MINI-CIRCUITS; Value: KSX2-442+; level: 1; line_number: 1275; ModifyDate: 5/14/13; M_PN: KSX2-442+; G_PN: MX02-20102; item_number: MX02-20102
U68 = MZD1-S0002: POWER SPLITTER/COMBINER;2225-2700 MHZ;0 DEG;FV1206-1 CASE; Value: SCN-2-27+; Approved: CL; NoLoad: .; MFGR: MINI-CIRCUITS; level: 1; line_number: 1280; ModifyDate: 11/19/14; G_PN: MZD1-S0002; item_number: MZD1-S0002
U69 U71 U72 = MC09-00002: MFGR: MINI_CIRCUITS; NoLoad: .; Approved: CL; Value: TCD-9-1W+; level: 1; line_number: 1285; ModifyDate: 5/18/12; G_PN: MC09-00002; item_number: MC09-00002
U70 = MA20-00006: M_PN: SKY65017-70LF; Approved: CL; MFGR: SKYWORKS; NoLoad: .; Value: SKY65017-70LF; level: 1; line_number: 1160; G_PN: MA20-00006; ModifyDate: 6/26/14; item_number: MA20-00006
U168 = MC10-00103: MFGR: MINI_CIRCUITS; NoLoad: .; Approved: CL; Value: BDCN-10-25+; level: 1; line_number: 1150; ModifyDate: 5/24/13; G_PN: MC10-00103; item_number: MC10-00103